# Altium schematic sheet [20]-CONNECT_CONNECTORS.SchDoc
size A4
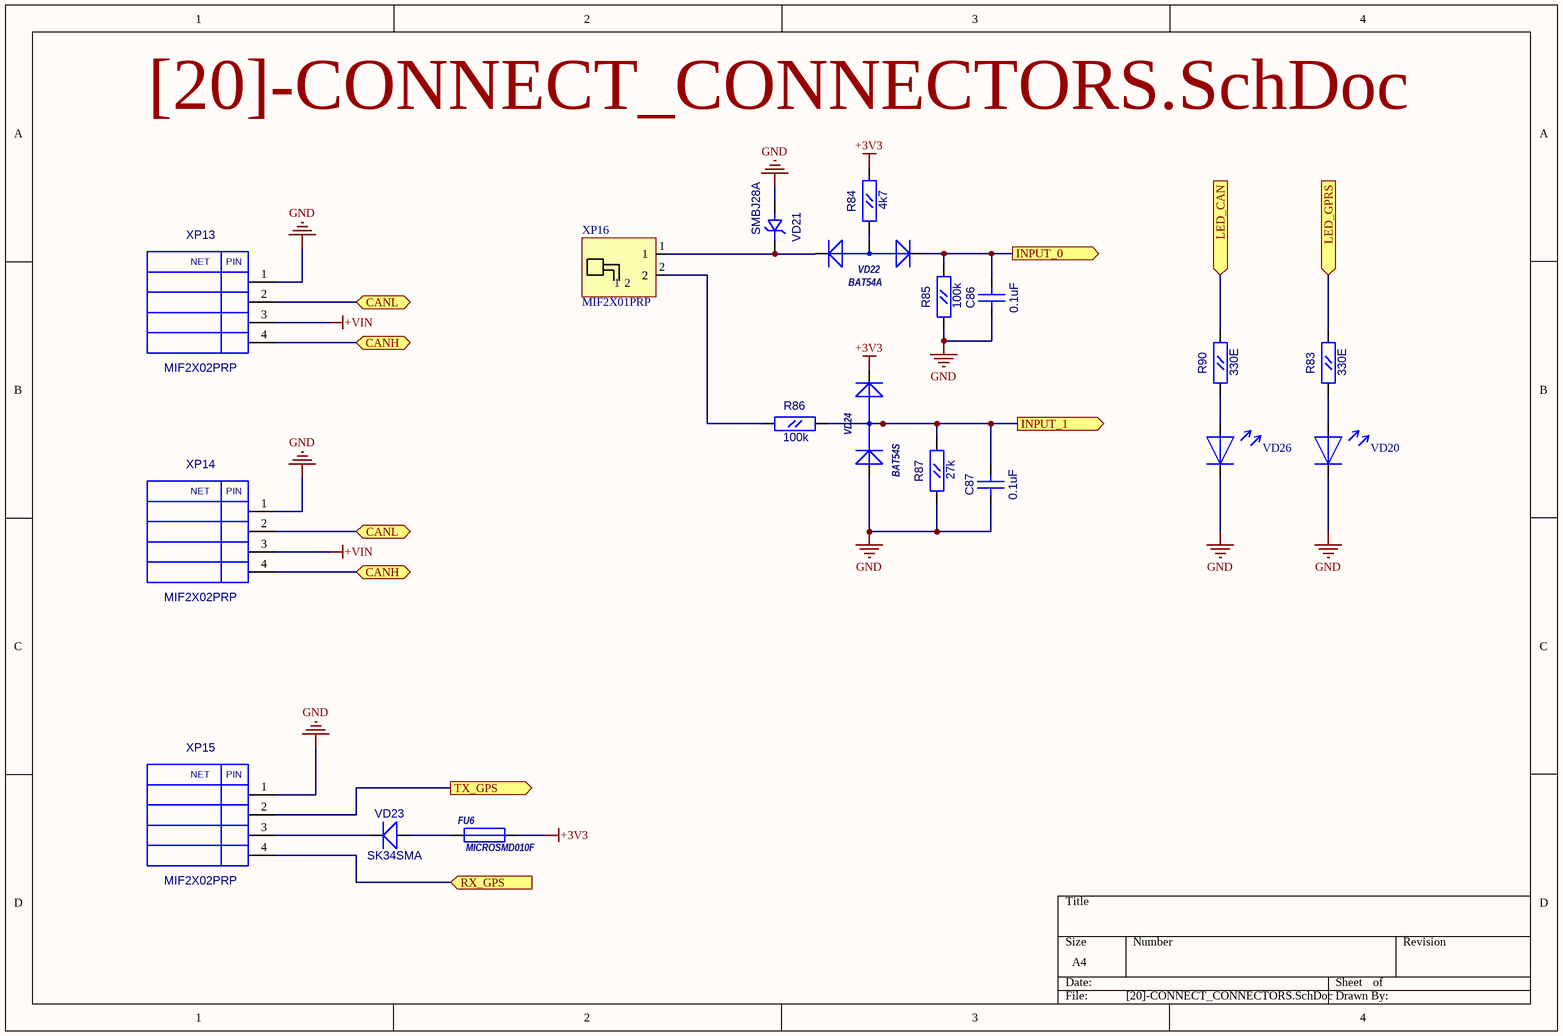
[diagram p0: [20]-CONNECT_CONNECTORS.SchDoc]

## Parts
C86  0.1uF  [CC0603]
C87  0.1uF  [CC0603]
FU6  MICROSMD010F  [RC1210]
R83  330E  [RC0603]
R84  4k7  [RC0603]
R85  100k  [RC0603]
R86  100k  [RC0603]
R87  27k  [RC0603]
R90  330E  [RC0603]
VD20  LED_0805  [LED0805]  (value not drawn)
VD21  SMBJ28A  [SMB]
VD22  BAT54A  [SOT-23(123)]
VD23  SK34SMA  [SMA]
VD24  BAT54S  [SOT-23(GSD)]
VD26  LED_0805  [LED0805]  (value not drawn)
XP13  MIF2X02PRP  [MIF2X02PRP]
XP14  MIF2X02PRP  [MIF2X02PRP]
XP15  MIF2X02PRP  [MIF2X02PRP]
XP16  MIF2X01PRP  [MIF2x01PRP]

## Ports
CANH (bidir), CANL (bidir), INPUT_0 (out), INPUT_1 (out), LED_CAN (in), LED_GPRS (in), RX_GPS (in), TX_GPS (out)

## Nets
+3V3: FU6.2 R84.2(B) VD24.2(K)
+VIN: XP13.3 XP14.3
GND: C86.1(A) C87.1(A) R85.1(A) R87.1(A) VD20.2 VD21.1(A) VD24.1(A) VD26.2 XP13.1 XP14.1 XP15.1
CANH: XP13.4 XP14.4 ; port CANH
CANL: XP13.2 XP14.2 ; port CANL
INPUT_0: C86.2(B) R85.2(B) VD22.2(K) ; port INPUT_0
INPUT_1: C87.2(B) R86.2(B) R87.2(B) VD24.3(AK) ; port INPUT_1
LED_CAN: R90.2(B) ; port LED_CAN
LED_GPRS: R83.2(B) ; port LED_GPRS
RX_GPS: XP15.4 ; port RX_GPS
TX_GPS: XP15.2 ; port TX_GPS
NetFU6_1: FU6.1 VD23.1(A)
NetR83_1: R83.1(A) VD20.1
NetR84_1: R84.1(A) VD22.3(A)
NetR86_1: R86.1(A) XP16.2
NetR90_1: R90.1(A) VD26.1
NetVD21_2: VD21.2(K) VD22.1(K) XP16.1
NetVD23_2: VD23.2(K) XP15.3

## Notes on the sheet
- (in symbol MIF2X02PRP) NET; PIN

## Library data of the parts
C86 C87 = CC0603: Value: 0.1uF
FU6 = MICROSMD: Value: MICROSMD010F
R83-R87 R90 = RC0603
  R83 R90: Value: 330E
  R84: Value: 4k7
  R85 R86: Value: 100k
  R87: Value: 27k
VD21 = SMBJ: Value: SMBJ28A
VD22 = BAT54A: 1.0 Ampere General Purpose Rectifier; ComponentField6: Published 8-Jun-2000, Modified 11-July-2000: SIM Model Added.; Value: *
VD23 = SK34SMA: Schottky Rectifier; Value: {Value}
VD24 = BAT54S: 1.0 Ampere General Purpose Rectifier; ComponentField6: Published 8-Jun-2000, Modified 11-July-2000: SIM Model Added.; Value: *
XP16 = MIF2X01PRP: Molex connector 3.0mm pitch; Value: MIF2X01PRP
VD20 VD26 = LED_0805: Value: LED_0805
XP13-XP15 = MIF2X02PRP: Value: *